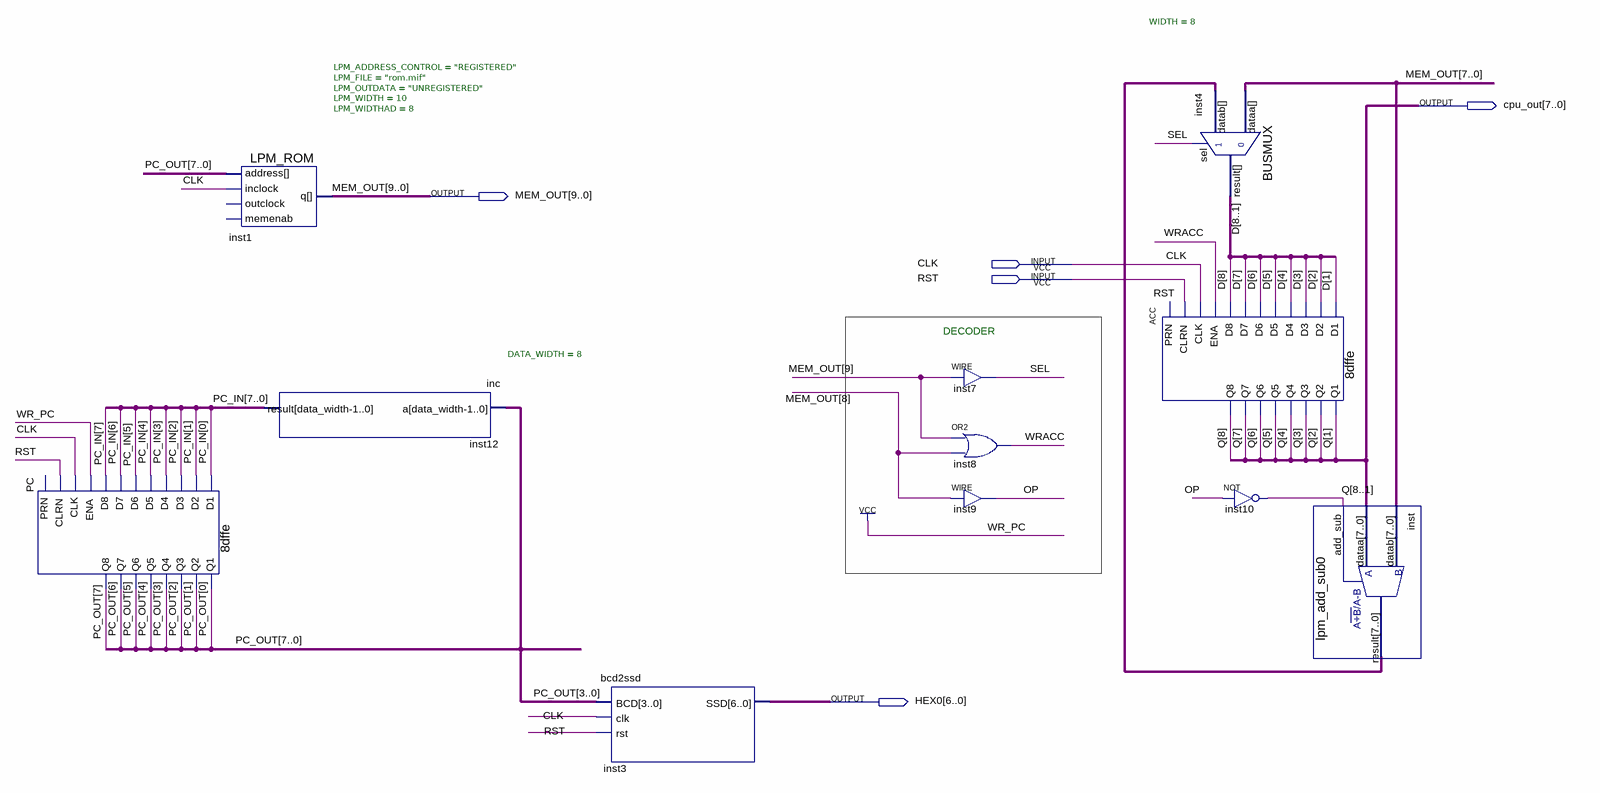
[diagram p0: schematic sheet]
// Quartus schematic first_cpu_mem.bdf as structural Verilog: 11 symbols, 5 pins
module first_cpu_mem (
  input  CLK,
  input  RST,
  output [7:0] cpu_out,
  output [9:0] MEM_OUT,
  output [6:0] HEX0
);

  wire inst10_out, OP, SEL, WRACC;
  wire [7:0] inst_result, PC_IN, PC_OUT;
  wire [8:1] D;

  \8dffe  PC (
    .CLRN(RST), .D2(PC_IN[1]), .D3(PC_IN[2]), .D4(PC_IN[3]), .D5(PC_IN[4]), .D8(PC_IN[7]), .D6(PC_IN[5]),
    .D7(PC_IN[6]), .CLK(CLK), .ENA(1'b1), .D1(PC_IN[0]), .Q8(PC_OUT[7]), .Q4(PC_OUT[3]), .Q6(PC_OUT[5]),
    .Q7(PC_OUT[6]), .Q3(PC_OUT[2]), .Q2(PC_OUT[1]), .Q1(PC_OUT[0]), .Q5(PC_OUT[4]));  // open: PRN
  LPM_ROM #(.LPM_ADDRESS_CONTROL("REGISTERED"), .LPM_FILE("rom.mif"), .LPM_OUTDATA("UNREGISTERED"), .LPM_WIDTH(10), .LPM_WIDTHAD(8)) inst1 (
    .address(PC_OUT), .inclock(CLK), .q(MEM_OUT));  // open: outclock, memenab
  inc #(.DATA_WIDTH(8)) inst12 (.a(PC_OUT), .result(PC_IN));
  bcd2ssd inst3 (.BCD(PC_OUT[3:0]), .clk(CLK), .rst(RST), .SSD(HEX0));
  assign SEL = MEM_OUT[9];  // WIRE inst7
  or inst8 (WRACC, MEM_OUT[9], MEM_OUT[8]);
  assign OP = MEM_OUT[8];  // WIRE inst9
  \8dffe  ACC (
    .CLRN(RST), .D2(D[2]), .D3(D[3]), .D4(D[4]), .D5(D[5]), .D8(D[8]), .D6(D[6]), .D7(D[7]), .CLK(CLK),
    .ENA(WRACC), .D1(D[1]), .Q8(cpu_out[7]), .Q4(cpu_out[3]), .Q6(cpu_out[5]), .Q7(cpu_out[6]),
    .Q3(cpu_out[2]), .Q2(cpu_out[1]), .Q1(cpu_out[0]), .Q5(cpu_out[4]));  // open: PRN
  BUSMUX #(.WIDTH(8)) inst4 (.datab(inst_result), .sel(SEL), .dataa(MEM_OUT[7:0]), .result(D));
  not inst10 (inst10_out, OP);
  lpm_add_sub0 inst (.add_sub(inst10_out), .dataa(cpu_out), .datab(MEM_OUT[7:0]), .result(inst_result));

  // Other names for the same wires on the sheet: Q[8:1] = cpu_out

  // Notes on the sheet:
  //   DECODER
endmodule
